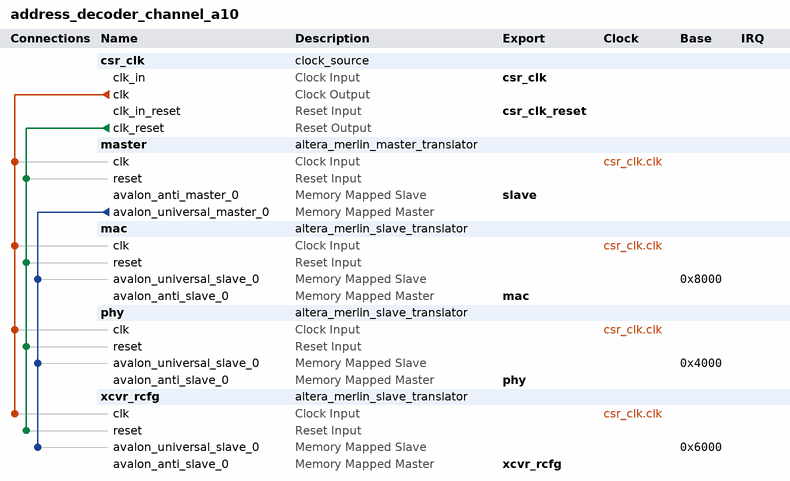
[diagram p0: system contents]
# Platform Designer (Qsys) system address_decoder_channel_a10, Arria 10 10AX115S4F45I3SGE2
# Parameters at their usual value, and those the tool derives, are not listed.
package require -exact qsys 15.1
create_system address_decoder_channel_a10
set_project_property DEVICE_FAMILY {Arria 10}
set_project_property DEVICE 10AX115S4F45I3SGE2

add_instance csr_clk clock_source 15.1
set_instance_parameter_value csr_clk clockFrequency 125000000

add_instance master altera_merlin_master_translator 15.1
set_instance_parameter_value master AV_ADDRESSGROUP 0
set_instance_parameter_value master AV_ADDRESS_SYMBOLS 1
set_instance_parameter_value master AV_ADDRESS_W 16
set_instance_parameter_value master AV_ALWAYSBURSTMAXBURST 0
set_instance_parameter_value master AV_BITS_PER_SYMBOL 8
set_instance_parameter_value master AV_BURSTBOUNDARIES 0
set_instance_parameter_value master AV_BURSTCOUNT_SYMBOLS 1
set_instance_parameter_value master AV_BURSTCOUNT_W 3
set_instance_parameter_value master AV_BYTEENABLE_W 4
set_instance_parameter_value master AV_CONSTANT_BURST_BEHAVIOR 0
set_instance_parameter_value master AV_DATA_HOLD 0
set_instance_parameter_value master AV_DATA_W 32
set_instance_parameter_value master AV_INTERLEAVEBURSTS 0
set_instance_parameter_value master AV_ISBIGENDIAN 0
set_instance_parameter_value master AV_LINEWRAPBURSTS 0
set_instance_parameter_value master AV_MAX_PENDING_READ_TRANSACTIONS 0
set_instance_parameter_value master AV_READLATENCY 0
set_instance_parameter_value master AV_READ_WAIT 0
set_instance_parameter_value master AV_REGISTERINCOMINGSIGNALS 0
set_instance_parameter_value master AV_REGISTEROUTGOINGSIGNALS 0
set_instance_parameter_value master AV_SETUP_WAIT 0
set_instance_parameter_value master AV_SYMBOLS_PER_WORD 4
set_instance_parameter_value master AV_WRITE_WAIT 0
set_instance_parameter_value master SYNC_RESET 0
set_instance_parameter_value master UAV_ADDRESSGROUP 0
set_instance_parameter_value master UAV_ADDRESS_W 32
set_instance_parameter_value master UAV_BURSTCOUNT_W 3
set_instance_parameter_value master UAV_CONSTANT_BURST_BEHAVIOR 0
set_instance_parameter_value master USE_ADDRESS 1
set_instance_parameter_value master USE_BEGINBURSTTRANSFER 0
set_instance_parameter_value master USE_BEGINTRANSFER 0
set_instance_parameter_value master USE_BURSTCOUNT 0
set_instance_parameter_value master USE_BYTEENABLE 0
set_instance_parameter_value master USE_CHIPSELECT 0
set_instance_parameter_value master USE_CLKEN 0
set_instance_parameter_value master USE_DEBUGACCESS 0
set_instance_parameter_value master USE_LOCK 0
set_instance_parameter_value master USE_READ 1
set_instance_parameter_value master USE_READDATA 1
set_instance_parameter_value master USE_READDATAVALID 0
set_instance_parameter_value master USE_READRESPONSE 0
set_instance_parameter_value master USE_WAITREQUEST 1
set_instance_parameter_value master USE_WRITE 1
set_instance_parameter_value master USE_WRITEDATA 1
set_instance_parameter_value master USE_WRITERESPONSE 0

add_instance mac altera_merlin_slave_translator 15.1
set_instance_parameter_value mac AV_ADDRESSGROUP 0
set_instance_parameter_value mac AV_ADDRESS_SYMBOLS 0
set_instance_parameter_value mac AV_ADDRESS_W 10
set_instance_parameter_value mac AV_ALWAYSBURSTMAXBURST 0
set_instance_parameter_value mac AV_BITS_PER_SYMBOL 8
set_instance_parameter_value mac AV_BURSTBOUNDARIES 0
set_instance_parameter_value mac AV_BURSTCOUNT_SYMBOLS 1
set_instance_parameter_value mac AV_BURSTCOUNT_W 1
set_instance_parameter_value mac AV_BYTEENABLE_W 4
set_instance_parameter_value mac AV_CONSTANT_BURST_BEHAVIOR 0
set_instance_parameter_value mac AV_DATA_HOLD 0
set_instance_parameter_value mac AV_DATA_W 32
set_instance_parameter_value mac AV_INTERLEAVEBURSTS 0
set_instance_parameter_value mac AV_ISBIGENDIAN 0
set_instance_parameter_value mac AV_LINEWRAPBURSTS 0
set_instance_parameter_value mac AV_MAX_PENDING_READ_TRANSACTIONS 1
set_instance_parameter_value mac AV_MAX_PENDING_WRITE_TRANSACTIONS 0
set_instance_parameter_value mac AV_READLATENCY 0
set_instance_parameter_value mac AV_READ_WAIT 0
set_instance_parameter_value mac AV_REGISTERINCOMINGSIGNALS 0
set_instance_parameter_value mac AV_REGISTEROUTGOINGSIGNALS 0
set_instance_parameter_value mac AV_REQUIRE_UNALIGNED_ADDRESSES 0
set_instance_parameter_value mac AV_SETUP_WAIT 0
set_instance_parameter_value mac AV_SYMBOLS_PER_WORD 4
set_instance_parameter_value mac AV_TIMING_UNITS 1
set_instance_parameter_value mac AV_WRITE_WAIT 0
set_instance_parameter_value mac CHIPSELECT_THROUGH_READLATENCY 0
set_instance_parameter_value mac CLOCK_RATE 125000000
set_instance_parameter_value mac UAV_ADDRESSGROUP 0
set_instance_parameter_value mac UAV_ADDRESS_W 12
set_instance_parameter_value mac UAV_BURSTCOUNT_W 3
set_instance_parameter_value mac UAV_BYTEENABLE_W 4
set_instance_parameter_value mac UAV_CONSTANT_BURST_BEHAVIOR 0
set_instance_parameter_value mac UAV_DATA_W 32
set_instance_parameter_value mac USE_ADDRESS 1
set_instance_parameter_value mac USE_AV_CLKEN 0
set_instance_parameter_value mac USE_BEGINBURSTTRANSFER 0
set_instance_parameter_value mac USE_BEGINTRANSFER 0
set_instance_parameter_value mac USE_BURSTCOUNT 0
set_instance_parameter_value mac USE_BYTEENABLE 0
set_instance_parameter_value mac USE_CHIPSELECT 0
set_instance_parameter_value mac USE_DEBUGACCESS 0
set_instance_parameter_value mac USE_LOCK 0
set_instance_parameter_value mac USE_OUTPUTENABLE 0
set_instance_parameter_value mac USE_READ 1
set_instance_parameter_value mac USE_READDATA 1
set_instance_parameter_value mac USE_READDATAVALID 0
set_instance_parameter_value mac USE_READRESPONSE 0
set_instance_parameter_value mac USE_UAV_CLKEN 0
set_instance_parameter_value mac USE_WAITREQUEST 1
set_instance_parameter_value mac USE_WRITE 1
set_instance_parameter_value mac USE_WRITEBYTEENABLE 0
set_instance_parameter_value mac USE_WRITEDATA 1
set_instance_parameter_value mac USE_WRITERESPONSE 0

add_instance phy altera_merlin_slave_translator 15.1
set_instance_parameter_value phy AV_ADDRESSGROUP 0
set_instance_parameter_value phy AV_ADDRESS_SYMBOLS 0
set_instance_parameter_value phy AV_ADDRESS_W 11
set_instance_parameter_value phy AV_ALWAYSBURSTMAXBURST 0
set_instance_parameter_value phy AV_BITS_PER_SYMBOL 8
set_instance_parameter_value phy AV_BURSTBOUNDARIES 0
set_instance_parameter_value phy AV_BURSTCOUNT_SYMBOLS 1
set_instance_parameter_value phy AV_BURSTCOUNT_W 1
set_instance_parameter_value phy AV_BYTEENABLE_W 4
set_instance_parameter_value phy AV_CONSTANT_BURST_BEHAVIOR 0
set_instance_parameter_value phy AV_DATA_HOLD 0
set_instance_parameter_value phy AV_DATA_W 32
set_instance_parameter_value phy AV_INTERLEAVEBURSTS 0
set_instance_parameter_value phy AV_ISBIGENDIAN 0
set_instance_parameter_value phy AV_LINEWRAPBURSTS 0
set_instance_parameter_value phy AV_MAX_PENDING_READ_TRANSACTIONS 1
set_instance_parameter_value phy AV_MAX_PENDING_WRITE_TRANSACTIONS 0
set_instance_parameter_value phy AV_READLATENCY 0
set_instance_parameter_value phy AV_READ_WAIT 0
set_instance_parameter_value phy AV_REGISTERINCOMINGSIGNALS 0
set_instance_parameter_value phy AV_REGISTEROUTGOINGSIGNALS 0
set_instance_parameter_value phy AV_REQUIRE_UNALIGNED_ADDRESSES 0
set_instance_parameter_value phy AV_SETUP_WAIT 0
set_instance_parameter_value phy AV_SYMBOLS_PER_WORD 4
set_instance_parameter_value phy AV_TIMING_UNITS 1
set_instance_parameter_value phy AV_WRITE_WAIT 0
set_instance_parameter_value phy CHIPSELECT_THROUGH_READLATENCY 0
set_instance_parameter_value phy CLOCK_RATE 125000000
set_instance_parameter_value phy UAV_ADDRESSGROUP 0
set_instance_parameter_value phy UAV_ADDRESS_W 13
set_instance_parameter_value phy UAV_BURSTCOUNT_W 3
set_instance_parameter_value phy UAV_BYTEENABLE_W 4
set_instance_parameter_value phy UAV_CONSTANT_BURST_BEHAVIOR 0
set_instance_parameter_value phy UAV_DATA_W 32
set_instance_parameter_value phy USE_ADDRESS 1
set_instance_parameter_value phy USE_AV_CLKEN 0
set_instance_parameter_value phy USE_BEGINBURSTTRANSFER 0
set_instance_parameter_value phy USE_BEGINTRANSFER 0
set_instance_parameter_value phy USE_BURSTCOUNT 0
set_instance_parameter_value phy USE_BYTEENABLE 0
set_instance_parameter_value phy USE_CHIPSELECT 0
set_instance_parameter_value phy USE_DEBUGACCESS 0
set_instance_parameter_value phy USE_LOCK 0
set_instance_parameter_value phy USE_OUTPUTENABLE 0
set_instance_parameter_value phy USE_READ 1
set_instance_parameter_value phy USE_READDATA 1
set_instance_parameter_value phy USE_READDATAVALID 0
set_instance_parameter_value phy USE_READRESPONSE 0
set_instance_parameter_value phy USE_UAV_CLKEN 0
set_instance_parameter_value phy USE_WAITREQUEST 1
set_instance_parameter_value phy USE_WRITE 1
set_instance_parameter_value phy USE_WRITEBYTEENABLE 0
set_instance_parameter_value phy USE_WRITEDATA 1
set_instance_parameter_value phy USE_WRITERESPONSE 0

add_instance xcvr_rcfg altera_merlin_slave_translator 15.1
set_instance_parameter_value xcvr_rcfg AV_ADDRESSGROUP 0
set_instance_parameter_value xcvr_rcfg AV_ADDRESS_SYMBOLS 0
set_instance_parameter_value xcvr_rcfg AV_ADDRESS_W 10
set_instance_parameter_value xcvr_rcfg AV_ALWAYSBURSTMAXBURST 0
set_instance_parameter_value xcvr_rcfg AV_BITS_PER_SYMBOL 8
set_instance_parameter_value xcvr_rcfg AV_BURSTBOUNDARIES 0
set_instance_parameter_value xcvr_rcfg AV_BURSTCOUNT_SYMBOLS 1
set_instance_parameter_value xcvr_rcfg AV_BURSTCOUNT_W 1
set_instance_parameter_value xcvr_rcfg AV_BYTEENABLE_W 4
set_instance_parameter_value xcvr_rcfg AV_CONSTANT_BURST_BEHAVIOR 0
set_instance_parameter_value xcvr_rcfg AV_DATA_HOLD 0
set_instance_parameter_value xcvr_rcfg AV_DATA_W 32
set_instance_parameter_value xcvr_rcfg AV_INTERLEAVEBURSTS 0
set_instance_parameter_value xcvr_rcfg AV_ISBIGENDIAN 0
set_instance_parameter_value xcvr_rcfg AV_LINEWRAPBURSTS 0
set_instance_parameter_value xcvr_rcfg AV_MAX_PENDING_READ_TRANSACTIONS 1
set_instance_parameter_value xcvr_rcfg AV_MAX_PENDING_WRITE_TRANSACTIONS 0
set_instance_parameter_value xcvr_rcfg AV_READLATENCY 0
set_instance_parameter_value xcvr_rcfg AV_READ_WAIT 0
set_instance_parameter_value xcvr_rcfg AV_REGISTERINCOMINGSIGNALS 0
set_instance_parameter_value xcvr_rcfg AV_REGISTEROUTGOINGSIGNALS 0
set_instance_parameter_value xcvr_rcfg AV_REQUIRE_UNALIGNED_ADDRESSES 0
set_instance_parameter_value xcvr_rcfg AV_SETUP_WAIT 0
set_instance_parameter_value xcvr_rcfg AV_SYMBOLS_PER_WORD 4
set_instance_parameter_value xcvr_rcfg AV_TIMING_UNITS 1
set_instance_parameter_value xcvr_rcfg AV_WRITE_WAIT 0
set_instance_parameter_value xcvr_rcfg CHIPSELECT_THROUGH_READLATENCY 0
set_instance_parameter_value xcvr_rcfg CLOCK_RATE 125000000
set_instance_parameter_value xcvr_rcfg UAV_ADDRESSGROUP 0
set_instance_parameter_value xcvr_rcfg UAV_ADDRESS_W 12
set_instance_parameter_value xcvr_rcfg UAV_BURSTCOUNT_W 3
set_instance_parameter_value xcvr_rcfg UAV_BYTEENABLE_W 4
set_instance_parameter_value xcvr_rcfg UAV_CONSTANT_BURST_BEHAVIOR 0
set_instance_parameter_value xcvr_rcfg UAV_DATA_W 32
set_instance_parameter_value xcvr_rcfg USE_ADDRESS 1
set_instance_parameter_value xcvr_rcfg USE_AV_CLKEN 0
set_instance_parameter_value xcvr_rcfg USE_BEGINBURSTTRANSFER 0
set_instance_parameter_value xcvr_rcfg USE_BEGINTRANSFER 0
set_instance_parameter_value xcvr_rcfg USE_BURSTCOUNT 0
set_instance_parameter_value xcvr_rcfg USE_BYTEENABLE 0
set_instance_parameter_value xcvr_rcfg USE_CHIPSELECT 0
set_instance_parameter_value xcvr_rcfg USE_DEBUGACCESS 0
set_instance_parameter_value xcvr_rcfg USE_LOCK 0
set_instance_parameter_value xcvr_rcfg USE_OUTPUTENABLE 0
set_instance_parameter_value xcvr_rcfg USE_READ 1
set_instance_parameter_value xcvr_rcfg USE_READDATA 1
set_instance_parameter_value xcvr_rcfg USE_READDATAVALID 0
set_instance_parameter_value xcvr_rcfg USE_READRESPONSE 0
set_instance_parameter_value xcvr_rcfg USE_UAV_CLKEN 0
set_instance_parameter_value xcvr_rcfg USE_WAITREQUEST 1
set_instance_parameter_value xcvr_rcfg USE_WRITE 1
set_instance_parameter_value xcvr_rcfg USE_WRITEBYTEENABLE 0
set_instance_parameter_value xcvr_rcfg USE_WRITEDATA 1
set_instance_parameter_value xcvr_rcfg USE_WRITERESPONSE 0

# connections
add_connection csr_clk.clk mac.clk clock
add_connection csr_clk.clk master.clk clock
add_connection csr_clk.clk phy.clk clock
add_connection csr_clk.clk xcvr_rcfg.clk clock
add_connection csr_clk.clk_reset mac.reset reset
add_connection csr_clk.clk_reset master.reset reset
add_connection csr_clk.clk_reset phy.reset reset
add_connection csr_clk.clk_reset xcvr_rcfg.reset reset
add_connection master.avalon_universal_master_0 mac.avalon_universal_slave_0 avalon
set_connection_parameter_value master.avalon_universal_master_0/mac.avalon_universal_slave_0 baseAddress 0x8000
add_connection master.avalon_universal_master_0 phy.avalon_universal_slave_0 avalon
set_connection_parameter_value master.avalon_universal_master_0/phy.avalon_universal_slave_0 baseAddress 0x4000
add_connection master.avalon_universal_master_0 xcvr_rcfg.avalon_universal_slave_0 avalon
set_connection_parameter_value master.avalon_universal_master_0/xcvr_rcfg.avalon_universal_slave_0 baseAddress 0x6000

# exported interfaces
add_interface csr_clk clock sink
set_interface_property csr_clk EXPORT_OF csr_clk.clk_in
add_interface csr_clk_reset reset sink
set_interface_property csr_clk_reset EXPORT_OF csr_clk.clk_in_reset
add_interface mac avalon master
set_interface_property mac EXPORT_OF mac.avalon_anti_slave_0
add_interface phy avalon master
set_interface_property phy EXPORT_OF phy.avalon_anti_slave_0
add_interface slave avalon slave
set_interface_property slave EXPORT_OF master.avalon_anti_master_0
add_interface xcvr_rcfg avalon master
set_interface_property xcvr_rcfg EXPORT_OF xcvr_rcfg.avalon_anti_slave_0

set_interconnect_requirement {$system} qsys_mm.clockCrossingAdapter HANDSHAKE
set_interconnect_requirement {$system} qsys_mm.maxAdditionalLatency 1

save_system address_decoder_channel_a10.qsys
